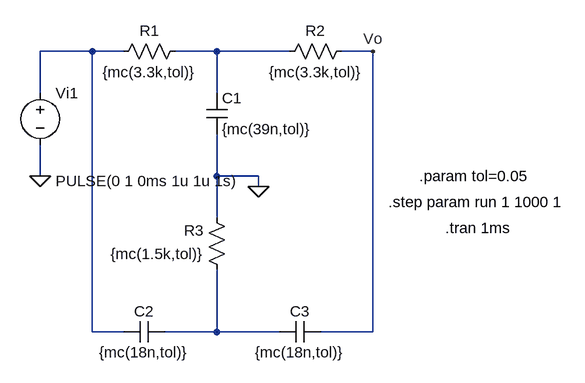
[diagram p0: schematic Respuesta al escalon.asc]
Respuesta al escalon.asc, the LTspice schematic file:
Version 4
SHEET 1 880 680
WIRE 0 -32 -80 -32
WIRE 48 -32 0 -32
WIRE 192 -32 128 -32
WIRE 304 -32 192 -32
WIRE 432 -32 384 -32
WIRE -80 32 -80 -32
WIRE 192 32 192 -32
WIRE -80 160 -80 112
WIRE 192 160 192 96
WIRE 256 160 192 160
WIRE 256 176 256 160
WIRE 192 224 192 160
WIRE 0 400 0 -32
WIRE 48 400 0 400
WIRE 192 400 192 304
WIRE 192 400 112 400
WIRE 288 400 192 400
WIRE 432 400 432 -32
WIRE 432 400 352 400
FLAG -80 160 0
FLAG 256 176 0
FLAG 432 -32 Vo
SYMBOL res 144 -48 R90
WINDOW 0 0 56 VBottom 2
WINDOW 3 32 56 VTop 2
SYMATTR InstName R1
SYMATTR Value {mc(3.3k,tol)}
SYMBOL res 400 -48 R90
WINDOW 0 0 56 VBottom 2
WINDOW 3 32 56 VTop 2
SYMATTR InstName R2
SYMATTR Value {mc(3.3k,tol)}
SYMBOL res 208 320 R180
WINDOW 0 36 76 Left 2
WINDOW 3 36 40 Left 2
SYMATTR InstName R3
SYMATTR Value {mc(1.5k,tol)}
SYMBOL cap 176 32 R0
SYMATTR InstName C1
SYMATTR Value {mc(39n,tol)}
SYMBOL cap 112 384 R90
WINDOW 0 0 32 VBottom 2
WINDOW 3 32 32 VTop 2
SYMATTR InstName C2
SYMATTR Value {mc(18n,tol)}
SYMBOL cap 352 384 R90
WINDOW 0 0 32 VBottom 2
WINDOW 3 32 32 VTop 2
SYMATTR InstName C3
SYMATTR Value {mc(18n,tol)}
SYMBOL voltage -80 16 R0
WINDOW 123 24 124 Left 2
WINDOW 39 0 0 Left 0
WINDOW 3 24 152 Left 2
SYMATTR Value PULSE(0 1 0ms 1u 1u 1s)
SYMATTR InstName Vi1
TEXT 544 240 Left 2 !.tran 1ms
TEXT 504 160 Left 2 !.param tol=0.05
TEXT 456 200 Left 2 !.step param run 1 1000 1

The netlist it stands for:
* Respuesta al escalon.asc
R1 N002 N001 {mc(3.3k,tol)}
R2 Vo N002 {mc(3.3k,tol)}
R3 N003 0 {mc(1.5k,tol)}
C1 N002 0 {mc(39n,tol)}
C2 N003 N001 {mc(18n,tol)}
C3 Vo N003 {mc(18n,tol)}
Vi1 N001 0 PULSE(0 1 0ms 1u 1u 1s)
.tran 1ms
.param tol=0.05
.step param run 1 1000 1
.backanno
.end